# Altium project PCB_Project1.PrjPCB
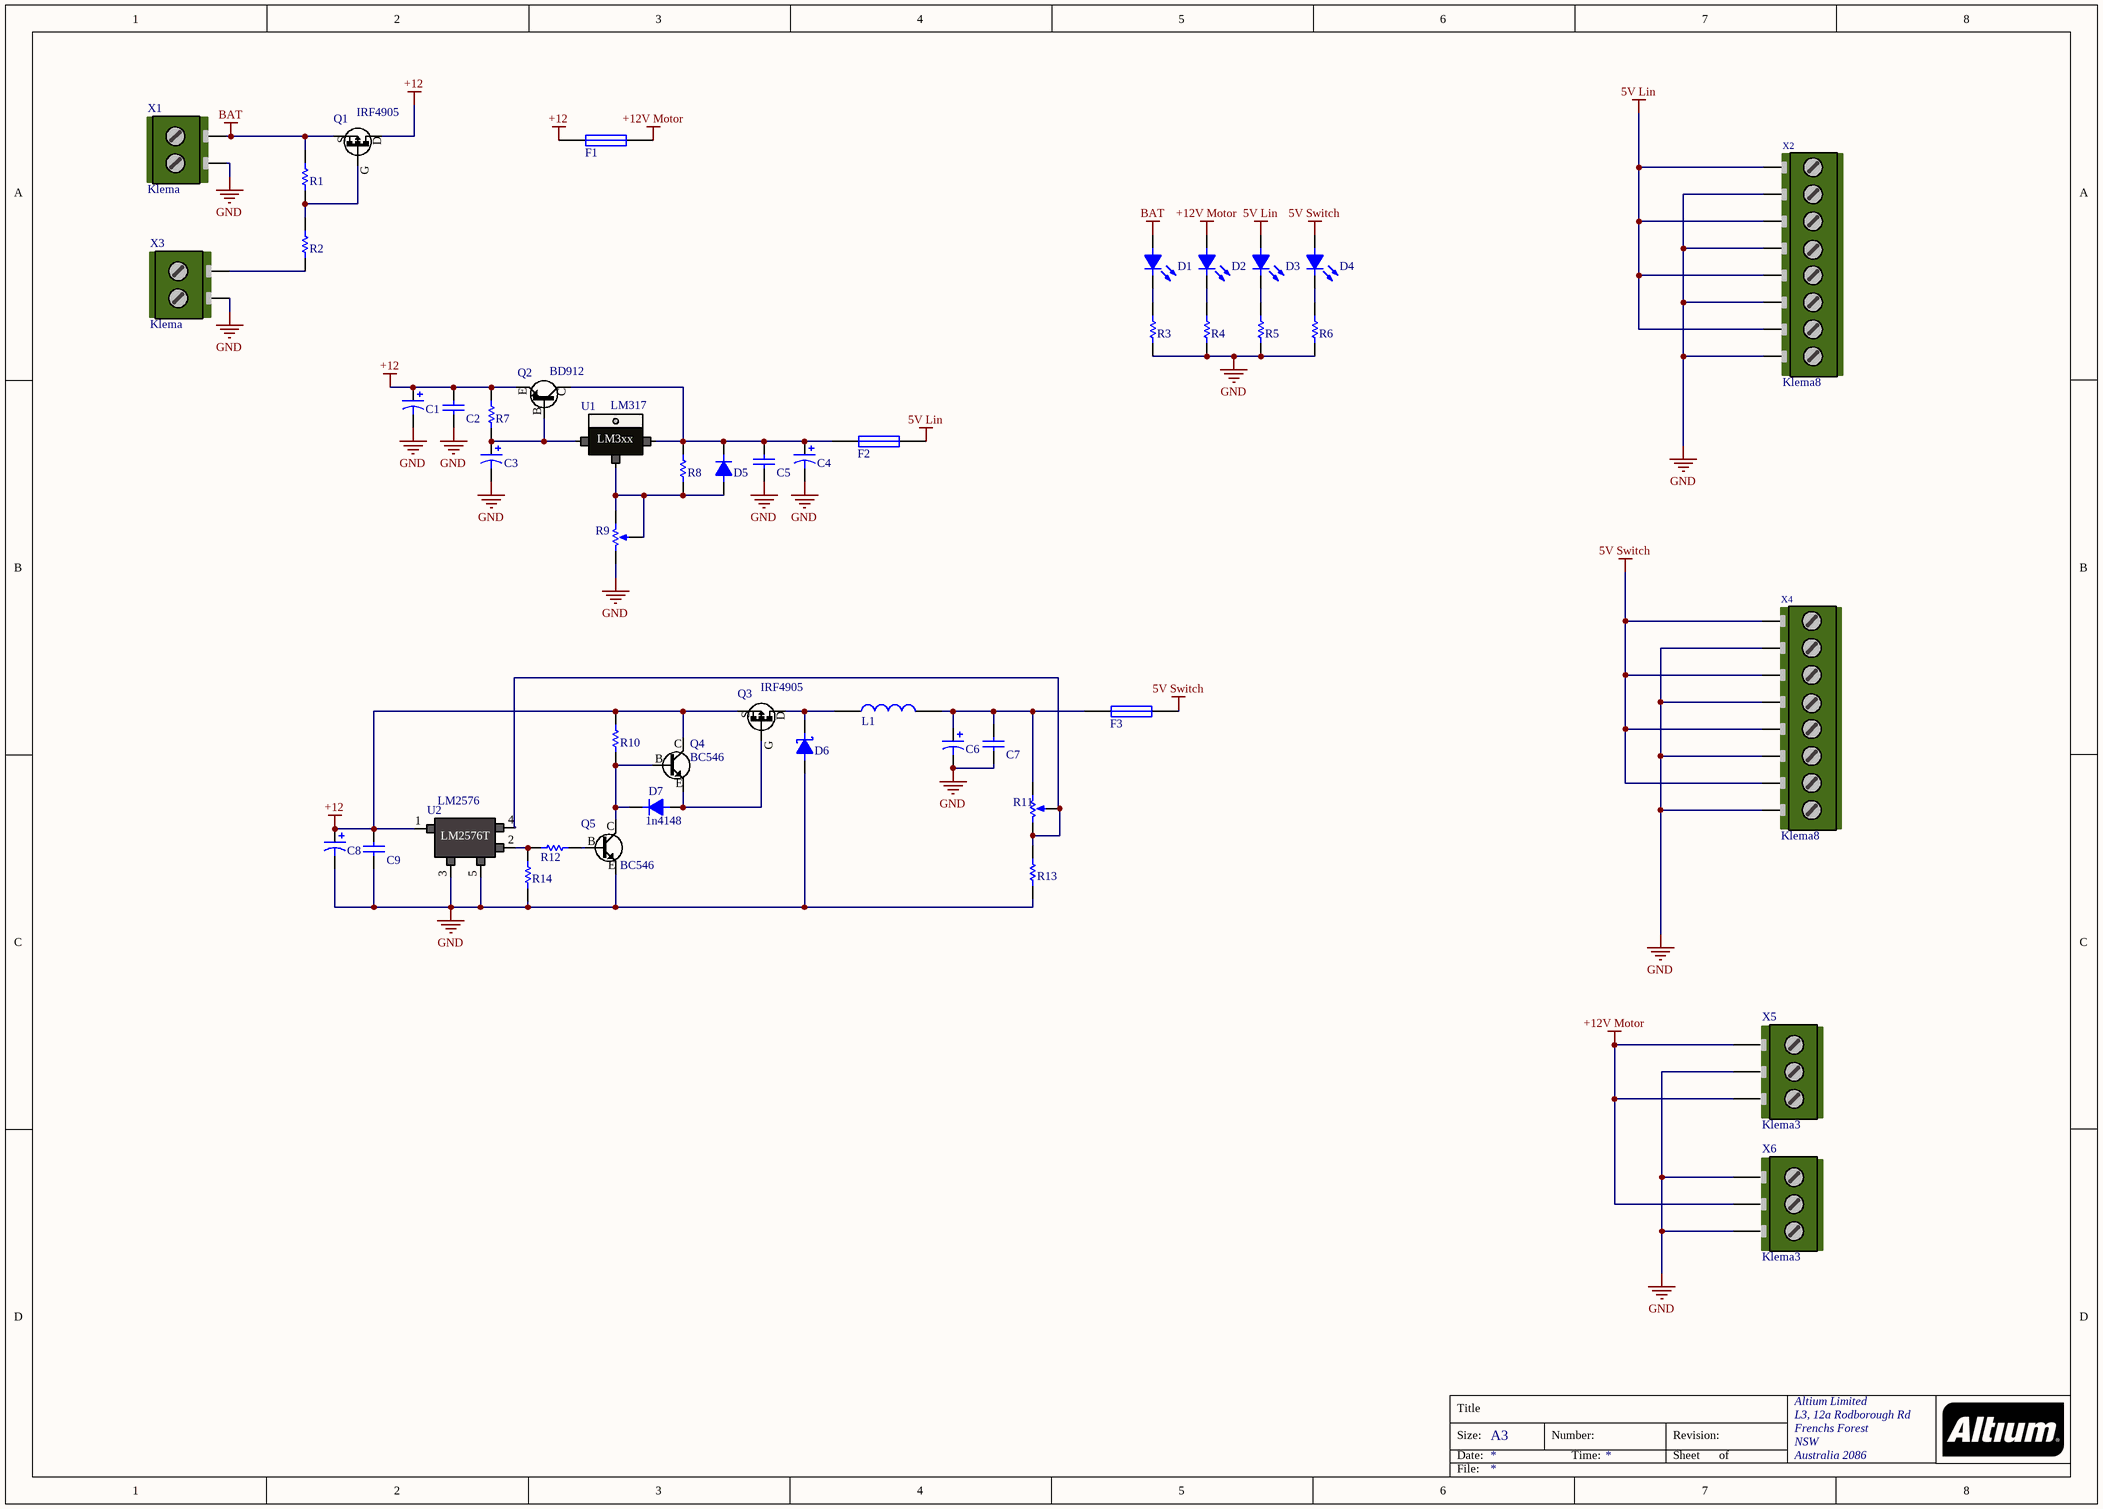
[diagram p0: Sheet1.SchDoc]
1 sheet, 47 parts. Net scope: global (net labels, ports and power ports of the same name join across sheets).
Board file: PCB1.PcbDoc

## Sheet Sheet1.SchDoc
size A3; Organization: Altium Limited; Address1: L3, 12a Rodborough Rd; Address2: Frenchs Forest; Address3: NSW; Address4: Australia 2086

### Parts
C1  Capacitor Electrolyt  [C2(elektrolit)]  (value not drawn)
C2  Capacitor Ceramic  [C1(ceramic)]  (value not drawn)
C3  Capacitor Electrolyt  [C2-Small]  (value not drawn)
C4  Capacitor Electrolyt  [C2(elektrolit)]  (value not drawn)
C5  Capacitor Ceramic  [C1(ceramic)]  (value not drawn)
C6  Capacitor Electrolyt  [C2(elektrolit)]  (value not drawn)
C7  Capacitor Ceramic  [C1(ceramic)]  (value not drawn)
C8  Capacitor Electrolyt  [C2(elektrolit)]  (value not drawn)
C9  Capacitor Ceramic  [C1(ceramic)]  (value not drawn)
D1  Diode LED  [LED(3mm)]  (value not drawn)
D2  Diode LED  [LED(3mm)]  (value not drawn)
D3  Diode LED  [LED(3mm)]  (value not drawn)
D4  Diode LED  [LED(3mm)]  (value not drawn)
D5  Diode Standard  [D1(300milsa)]  (value not drawn)
D6  Diode Shottky  [D2(5A)]  (value not drawn)
D7  1n4148  [D1(300milsa)]
F1  Fuse  [Osigurac]  (value not drawn)
F2  Fuse  [Osigurac]  (value not drawn)
F3  Fuse  [Osigurac]  (value not drawn)
L1  Inductor  [Kalem]  (value not drawn)
Q1  IRF4905  [TO220]
Q2  BD912  [BD912]
Q3  IRF4905  [TO220]
Q4  BC546  [TO-92]
Q5  BC546  [TO-92]
R1  Resistor Fixed  [R1(300milsa)]  (value not drawn)
R2  Resistor Fixed  [R1(300milsa)]  (value not drawn)
R3  Resistor Fixed  [R1(300milsa)]  (value not drawn)
R4  Resistor Fixed  [R1(300milsa)]  (value not drawn)
R5  Resistor Fixed  [R1(300milsa)]  (value not drawn)
R6  Resistor Fixed  [R1(300milsa)]  (value not drawn)
R7  Resistor Fixed  [R1(300milsa)]  (value not drawn)
R8  Resistor Fixed  [R1(300milsa)]  (value not drawn)
R9  Resistor Variable  [TRIM]  (value not drawn)
R10  Resistor Fixed  [R1(300milsa)]  (value not drawn)
R11  Resistor Variable  [TRIM]  (value not drawn)
R12  Resistor Fixed  [R1(300milsa)]  (value not drawn)
R13  Resistor Fixed  [R1(300milsa)]  (value not drawn)
R14  Resistor Fixed  [R1(300milsa)]  (value not drawn)
U1  LM317  [TO220]
U2  LM2576  [LM2576]
X1  Klema  [Klema]
X2  Klema8  [KLEMA8]
X3  Klema  [Klema]
X4  Klema8  [KLEMA8]
X5  Klema3  [Klema3]
X6  Klema3  [Klema3]

### Nets
5V Lin: D3.1(A) F2.2 X2.1 X2.3 X2.5 X2.7
5V Switch: D4.1(A) F3.2 X4.1 X4.3 X4.5 X4.7
+12: C1.1 C2.1 C8.1 C9.2 F1.1 Q1.2 Q2.3 Q3.3 Q4.3 R7.2 R10.2 U2.1
+12V Motor: D2.1(A) F1.2 X5.1 X5.3 X6.2
BAT: D1.1(A) Q1.3 R1.2 X1.2
GND: C1.2 C2.2 C3.2 C4.2 C5.2 C6.2 C7.1 C8.2 C9.1 D6.1(A) Q5.2 R3.1 R4.1 R5.1 R6.1 R9.3(BOT) R13.1 R14.1 U2.3 U2.5 X1.1 X2.2 X2.4 X2.6 X2.8 X3.1 X4.2 X4.4 X4.6 X4.8 X5.2 X6.1 X6.3
NetC3_1: C3.1 Q2.1 R7.1 U1.3
NetC4_1: C4.1 C5.1 D5.2(K) F2.1 Q2.2 R8.2 U1.2
NetC6_1: C6.1 C7.2 F3.1 L1.2 R11.1(TOP)
NetD1_2: D1.2(K) R3.2
NetD2_2: D2.2(K) R4.2
NetD3_2: D3.2(K) R5.2
NetD4_2: D4.2(K) R6.2
NetD5_1: D5.1(A) R8.1 R9.1(TOP) R9.2(TAP) U1.1
NetD6_2: D6.2(K) L1.1 Q3.2
NetD7_1: D7.1(A) Q3.1 Q4.2
NetD7_2: D7.2(K) Q4.1 Q5.3 R10.1
NetQ1_1: Q1.1 R1.1 R2.2
NetQ5_1: Q5.1 R12.2
NetR2_1: R2.1 X3.2
NetR11_2: R11.2(TAP) R11.3(BOT) R13.2 U2.4
NetR12_1: R12.1 R14.2 U2.2

### Notes on the sheet
- Title
- Size:
- Date:
- A3
- Number:
- Time:
- Revision:
- Sheet
- of
- File:
- (in symbol BD912) E; C; B
- (in symbol LM317/LM350) LM3xx
- (in symbol LM2576) LM2576T
- (in symbol P-Channel MOSFET) S; D; G
- (in symbol Transistor NPN) C; B; E
- (in symbol C2) +

### Library data of the parts
D7 = Diode Standard
Q1 Q3 = P-Channel MOSFET
Q4 Q5 = Transistor NPN
R1-R8 R10 R12-R14 = Resistor Fixed: Value: 1K
U1 = LM317/LM350